# Altium schematic sheet 00-ps2-blueretro.SchDoc
size A; SheetNumber: 1; SheetTotal: 6
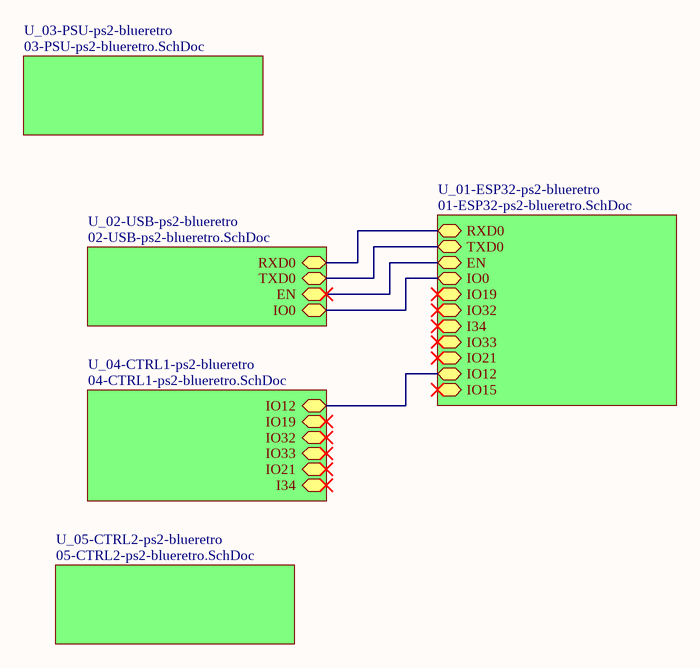
[diagram p0: 00-ps2-blueretro.SchDoc]

## Sub-sheets
U_01-ESP32-ps2-blueretro = 01-ESP32-ps2-blueretro.SchDoc: RXD0 (bidir), TXD0 (bidir), EN (bidir), IO0 (bidir), IO19 (bidir), IO32 (bidir), I34 (bidir), IO33 (bidir), IO21 (bidir), IO12 (bidir), IO15 (bidir)
U_02-USB-ps2-blueretro = 02-USB-ps2-blueretro.SchDoc: RXD0 (bidir), TXD0 (bidir), EN (bidir), IO0 (bidir)
U_03-PSU-ps2-blueretro = 03-PSU-ps2-blueretro.SchDoc: no entries
U_04-CTRL1-ps2-blueretro = 04-CTRL1-ps2-blueretro.SchDoc: IO19 (bidir), IO32 (bidir), IO33 (bidir), IO21 (bidir), I34 (bidir), IO12 (bidir)
U_05-CTRL2-ps2-blueretro = 05-CTRL2-ps2-blueretro.SchDoc: no entries

## Nets
(unnamed): sheet U_01-ESP32-ps2-blueretro/RXD0, sheet U_02-USB-ps2-blueretro/RXD0
(unnamed): sheet U_01-ESP32-ps2-blueretro/TXD0, sheet U_02-USB-ps2-blueretro/TXD0
(unnamed): sheet U_01-ESP32-ps2-blueretro/EN, sheet U_02-USB-ps2-blueretro/EN
(unnamed): sheet U_01-ESP32-ps2-blueretro/IO0, sheet U_02-USB-ps2-blueretro/IO0
(unnamed): sheet U_01-ESP32-ps2-blueretro/IO12, sheet U_04-CTRL1-ps2-blueretro/IO12